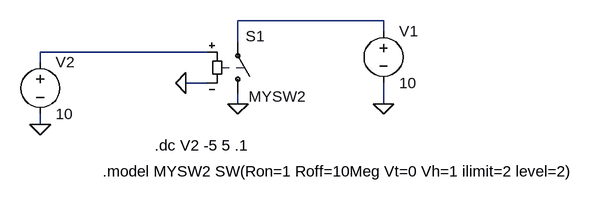
[diagram p0: schematic ph.asc]
ph.asc, the LTspice schematic file:
Version 4
SHEET 1 1276 680
WIRE 464 112 240 112
WIRE 464 128 464 112
WIRE 240 144 240 112
WIRE 192 160 -64 160
WIRE -64 176 -64 160
WIRE 192 208 160 208
WIRE 240 240 240 224
WIRE 464 240 464 208
WIRE -64 272 -64 256
FLAG -64 272 0
FLAG 464 240 0
FLAG 240 240 0
FLAG 160 208 0
SYMBOL voltage 464 112 R0
SYMATTR Value 10
SYMATTR InstName V1
SYMBOL sw 240 240 M180
WINDOW 0 12 104 Left 2
WINDOW 3 17 11 Left 2
SYMATTR InstName S1
SYMATTR Value MYSW2
SYMBOL voltage -64 160 R0
SYMATTR InstName V2
SYMATTR Value 10
TEXT 112 304 Left 2 !.dc V2 -5 5 .1
TEXT 32 344 Left 2 !.model MYSW2 SW(Ron=1 Roff=10Meg Vt=0 Vh=1 ilimit=2 level=2)

The netlist it stands for:
* ph.asc
V1 N001 0 10
S1 0 N001 N002 0 MYSW2
V2 N002 0 10
.dc V2 -5 5 .1
.model MYSW2 SW(Ron=1 Roff=10Meg Vt=0 Vh=1 ilimit=2 level=2)
.backanno
.end